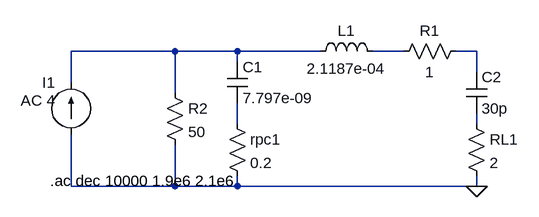
[diagram p0: schematic eje2.asc]
eje2.asc, the LTspice schematic file:
Version 4
SHEET 1 880 680
WIRE -112 -48 -272 -48
WIRE -16 -48 -112 -48
WIRE 112 -48 -16 -48
WIRE 240 -48 192 -48
WIRE 352 -48 320 -48
WIRE -16 -32 -16 -48
WIRE 352 -16 352 -48
WIRE -272 0 -272 -48
WIRE -112 16 -112 -48
WIRE -16 64 -16 32
WIRE 352 64 352 48
WIRE -272 160 -272 80
WIRE -112 160 -112 96
WIRE -112 160 -272 160
WIRE -16 160 -16 144
WIRE -16 160 -112 160
WIRE 352 160 352 144
WIRE 352 160 -16 160
FLAG 352 160 0
SYMBOL res 336 48 R0
SYMATTR InstName RL1
SYMATTR Value 2
SYMBOL cap -32 -32 R0
SYMATTR InstName C1
SYMATTR Value 7.797e-09
SYMATTR SpiceLine Rser=0
SYMBOL ind 96 -32 R270
WINDOW 0 32 56 VTop 2
WINDOW 3 5 56 VBottom 2
SYMATTR InstName L1
SYMATTR Value 2.1187e-04
SYMATTR SpiceLine Rser=0
SYMBOL res -32 48 R0
SYMATTR InstName rpc1
SYMATTR Value 0.2
SYMBOL res 336 -64 R90
WINDOW 0 0 56 VBottom 2
WINDOW 3 32 56 VTop 2
SYMATTR InstName R1
SYMATTR Value 1
SYMBOL cap 336 -16 R0
SYMATTR InstName C2
SYMATTR Value 30p
SYMBOL res -128 0 R0
SYMATTR InstName R2
SYMATTR Value 50
SYMBOL current -272 80 R180
WINDOW 0 24 80 Left 2
WINDOW 3 24 0 Left 2
WINDOW 123 24 52 Left 2
WINDOW 39 0 0 Left 2
SYMATTR InstName I1
SYMATTR Value ""
SYMATTR Value2 AC 4
TEXT -304 152 Left 2 !.ac dec 10000 1.9e6 2.1e6

The netlist it stands for:
* eje2.asc
RL1 N005 0 2
C1 N001 N004 7.797e-09 Rser=0
L1 N001 N002 2.1187e-04 Rser=0
rpc1 N004 0 0.2
R1 N003 N002 1
C2 N003 N005 30p
R2 N001 0 50
I1 0 N001 AC 4
.ac dec 10000 1.9e6 2.1e6
.backanno
.end